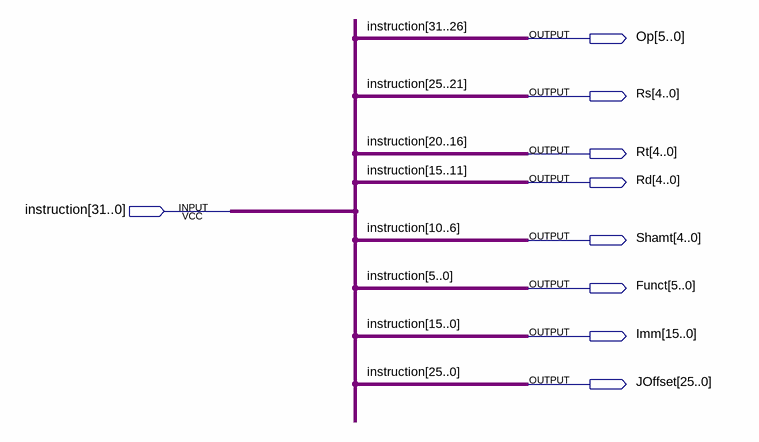
[diagram p0: schematic sheet]
// Quartus schematic InstDecoder.bdf as structural Verilog: 0 symbols, 9 pins
module InstDecoder (
  input  [31:0] instruction,
  output [5:0] Op,
  output [4:0] Rs,
  output [4:0] Rt,
  output [4:0] Rd,
  output [4:0] Shamt,
  output [5:0] Funct,
  output [15:0] Imm,
  output [25:0] JOffset
);


  assign Funct = instruction[5:0];
  assign Imm = instruction[15:0];
  assign JOffset = instruction[25:0];
  assign Op = instruction[31:26];
  assign Rd = instruction[15:11];
  assign Rs = instruction[25:21];
  assign Rt = instruction[20:16];
  assign Shamt = instruction[10:6];
endmodule
